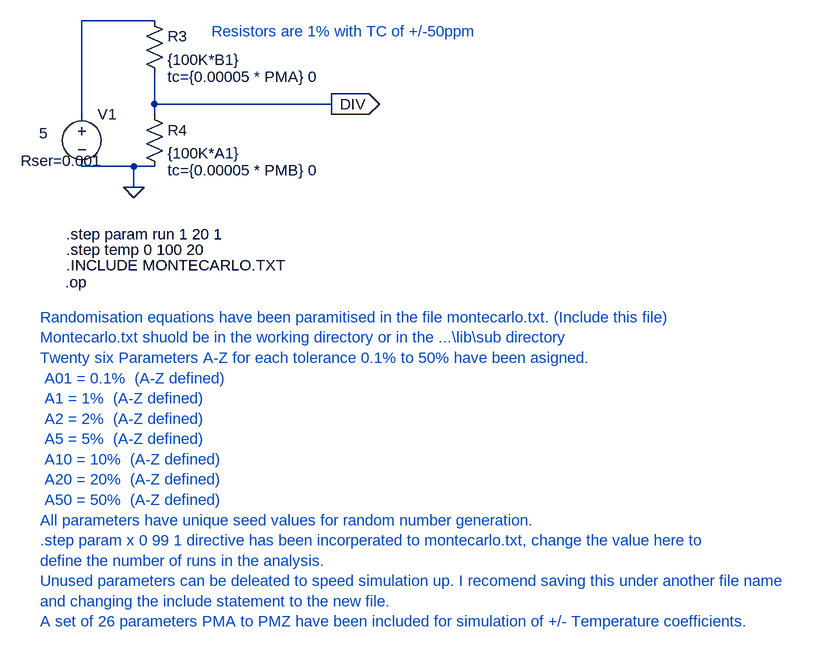
[diagram p0: schematic montecarlo_TC_test.asc]
montecarlo_TC_test.asc, the LTspice schematic file:
Version 4
SHEET 1 1316 964
WIRE -48 192 -48 48
WIRE 64 128 64 176
WIRE -48 272 32 272
WIRE 32 304 32 272
WIRE 32 272 64 272
WIRE -48 48 64 48
WIRE 336 176 64 176
WIRE 64 176 64 192
FLAG 32 304 0
FLAG 336 176 DIV
IOPIN 336 176 Out
SYMBOL voltage -48 176 R0
WINDOW 3 -66 45 Left 0
WINDOW 123 0 0 Left 0
WINDOW 39 -94 87 Left 0
SYMATTR Value 5
SYMATTR SpiceLine Rser=0.001
SYMATTR InstName V1
SYMBOL res 48 176 R0
WINDOW 39 36 102 Left 0
SYMATTR SpiceLine tc={0.00005 * PMB} 0
SYMATTR InstName R4
SYMATTR Value {100K*A1}
SYMBOL res 48 32 R0
WINDOW 39 36 102 Left 0
SYMATTR SpiceLine tc={0.00005 * PMA} 0
SYMATTR InstName R3
SYMATTR Value {100K*B1}
TEXT -74 450 Left 0 !.op
TEXT -72 400 Left 0 !.step temp 0 100 20
TEXT -72 424 Left 0 !.INCLUDE MONTECARLO.TXT
TEXT 152 64 Left 0 ;Resistors are 1% with TC of +/-50ppm
TEXT -112 504 Left 0 ;Randomisation equations have been paramitised in the file montecarlo.txt. (Include this file)\nMontecarlo.txt shuold be in the working directory or in the ...\\lib\\sub directory\nTwenty six Parameters A-Z for each tolerance 0.1% to 50% have been asigned.\n A01 = 0.1%  (A-Z defined)\n A1 = 1%  (A-Z defined)\n A2 = 2%  (A-Z defined)\n A5 = 5%  (A-Z defined)\n A10 = 10%  (A-Z defined)\n A20 = 20%  (A-Z defined)\n A50 = 50%  (A-Z defined)\nAll parameters have unique seed values for random number generation.\n.step param x 0 99 1 directive has been incorperated to montecarlo.txt, change the value here to\ndefine the number of runs in the analysis.\nUnused parameters can be deleated to speed simulation up. I recomend saving this under another file name \nand changing the include statement to the new file.\nA set of 26 parameters PMA to PMZ have been included for simulation of +/- Temperature coefficients.
TEXT -72 376 Left 0 !.step param run 1 20 1

The netlist it stands for:
* montecarlo_TC_test.asc
V1 N001 0 5 Rser=0.001
R4 DIV 0 {100K*A1} tc={0.00005 * PMB} 0
R3 N001 DIV {100K*B1} tc={0.00005 * PMA} 0
.op
.step temp 0 100 20
.INCLUDE MONTECARLO.TXT
* Resistors are 1% with TC of +/-50ppm
* Randomisation equations have been paramitised in the file montecarlo.txt. (Include this file)
* Montecarlo.txt shuold be in the working directory or in the ...\lib\sub directory
* Twenty six Parameters A-Z for each tolerance 0.1% to 50% have been asigned.
*  A01 = 0.1%  (A-Z defined)
*  A1 = 1%  (A-Z defined)
*  A2 = 2%  (A-Z defined)
*  A5 = 5%  (A-Z defined)
*  A10 = 10%  (A-Z defined)
*  A20 = 20%  (A-Z defined)
*  A50 = 50%  (A-Z defined)
* All parameters have unique seed values for random number generation.
* .step param x 0 99 1 directive has been incorperated to montecarlo.txt, change the value here to
* define the number of runs in the analysis.
* Unused parameters can be deleated to speed simulation up. I recomend saving this under another file name
* and changing the include statement to the new file.
* A set of 26 parameters PMA to PMZ have been included for simulation of +/- Temperature coefficients.
.step param run 1 20 1
.backanno
.end